# EAGLE design round-epaper-demo (EAGLE 7.5.0)
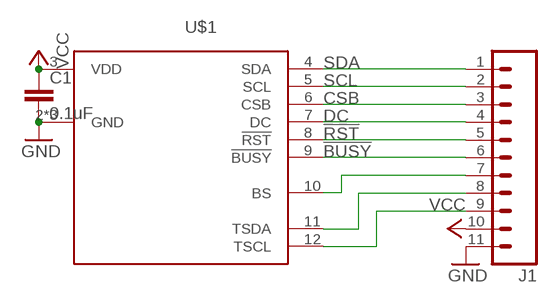
[diagram p0: schematic, sheet 1]

## Parts
C1  0.1uF  CAP0603-CAP  [0603-CAP]
J1  M11PTH  [1X11]
U$1  GDEP011TT2  [FH26W-15S-0.3S]

## Nets
!BUSY: J1.6 U$1.9(!BUSY)
!RST: J1.5 U$1.8(!RST)
BS: J1.7 U$1.10(BS)
CSB: J1.3 U$1.6(CSB)
DC: J1.4 U$1.7(DC)
GND [power]: C1.2 J1.11 U$1.2(GND) U$1.EXP1(GND) U$1.EXP2(GND)
SCL: J1.2 U$1.5(SCL)
SDA: J1.1 U$1.4(SDA)
TSCL: J1.9 U$1.12(TSCL)
TSDA: J1.8 U$1.11(TSDA)
VCC [power]: C1.1 J1.10 U$1.3(VDD)

## Library data of the parts
C1 = SparkFun-Capacitors:CAP: Capacitor Standard 0603 ceramic capacitor, and 0.1" leaded capacitor.
J1 = SparkFun-Connectors:M11: Header 11 Standard 11-pin 0.1" header. Use with straight break away headers (SKU : PRT-00116), right angle break away headers (PRT-00553), swiss pins (PRT-00743), machine pins (PRT-00117), and female headers (PRT-00115).
U$1 = sonik:GDEP011TT2

## Net classes
2 power: width 0.254 mm

## Board
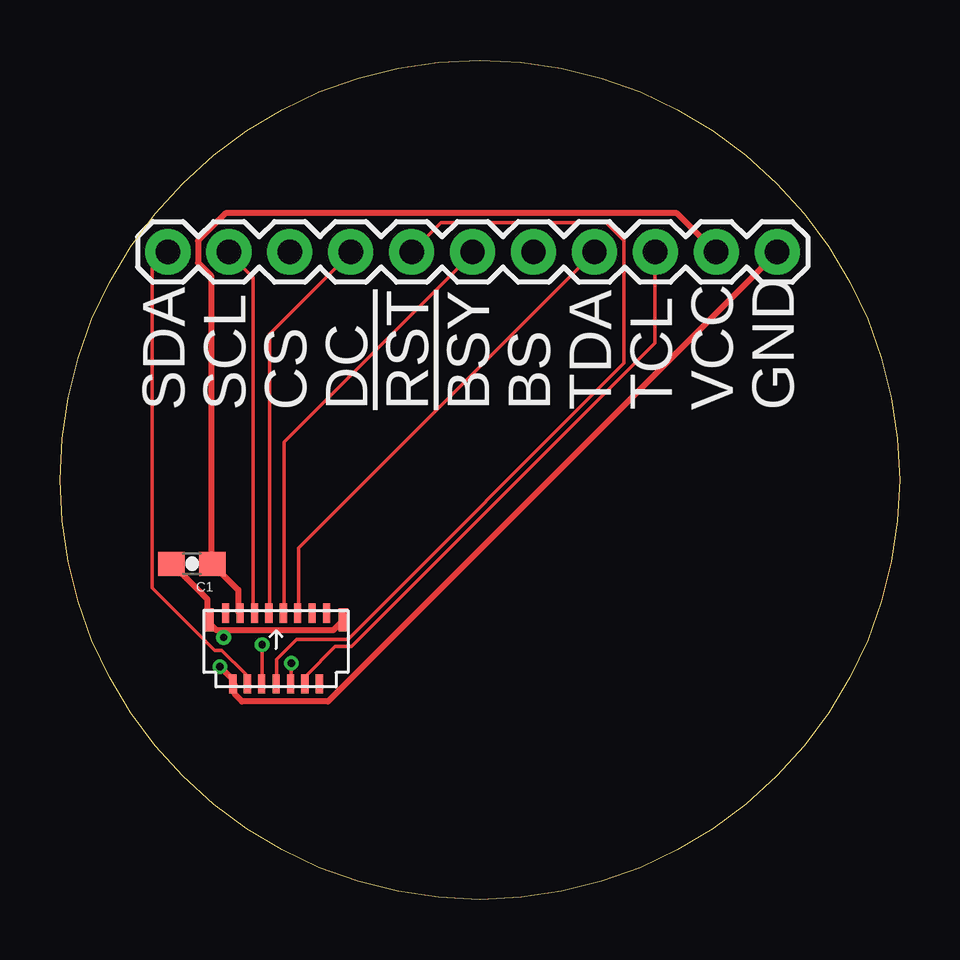
[diagram p1: board, top side]
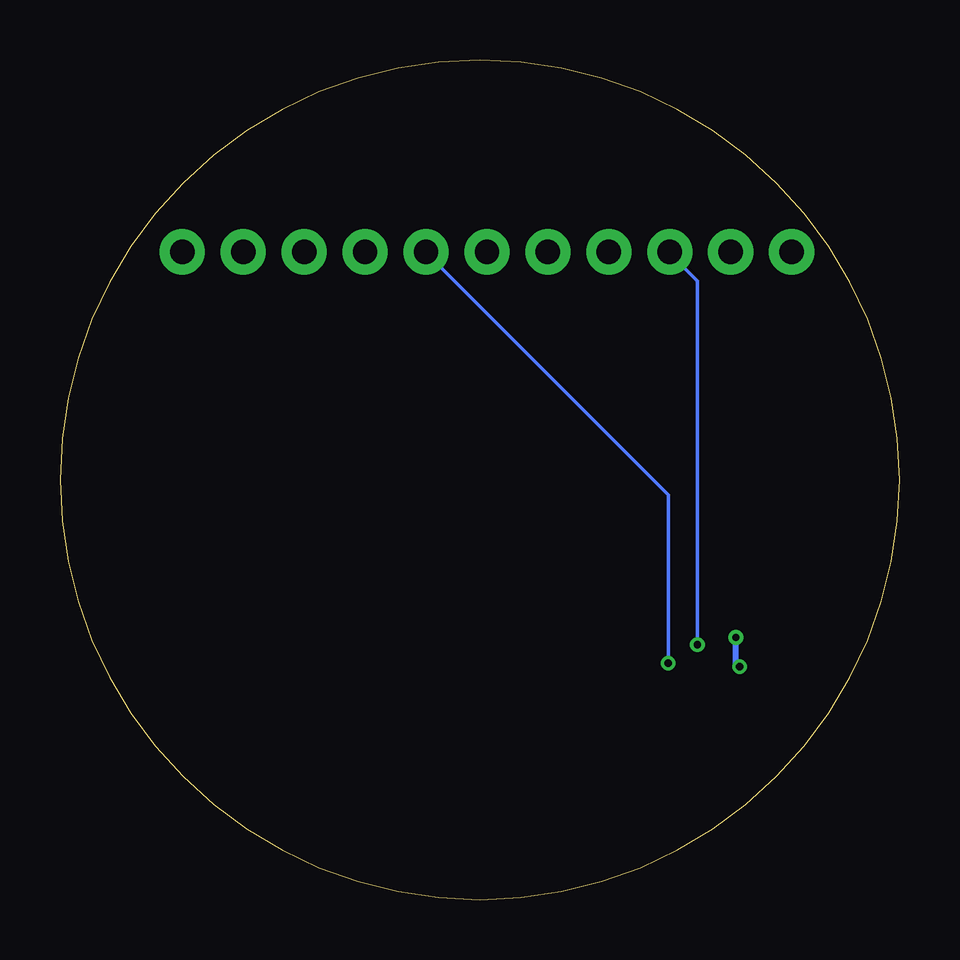
[diagram p2: board, bottom side, seen from below]

Size 35 x 35 mm. Coordinates in mm from the lower left corner, seen from the top.
Outline: 17.5,35 arc-180 17.5,0 arc-180 17.5,35
Copper layers (1*16): Top 0.035mm / dielectric 1.5mm / Bottom 0.035mm
Design rules "MF_Standard_2_Layer": minimum track width 6mil, minimum drill 12mil, track to track 6mil, track to pad 6mil, pad to pad 6mil, via to via 6mil, smd to smd 0mil, copper to edge 10mil, drill to drill 10mil, minimum pad ring 6mil, minimum via ring 6mil, stop-mask expansion 2mil, vias tented up to drill 25mil, thermal gap 10mil

### Footprints (pad centres in the part's own frame; a part is rotated, then mirrored left to right if it is on the bottom)
0603-CAP = smd 1.1 x 1: 1 -0.85,0; 2 0.85,0
1X11 = drill 1.016 pad 1.88: 1 0,0; 2 2.54,0; 3 5.08,0; 4 7.62,0; 5 10.16,0; 6 12.7,0; 7 15.24,0; 8 17.78,0; 9 20.32,0; 10 22.86,0; 11 25.4,0
FH26W-15S-0.3S = smd 0.3 x 0.8: 1 2.1,-1.475; 2 1.8,1.475; 3 1.5,-1.475; 4 1.2,1.475; 5 0.9,-1.475; 6 0.6,1.475; 7 0.3,-1.475; 8 0,1.475; 9 -0.3,-1.475; 10 -0.6,1.475; 11 -0.9,-1.475; 12 -1.2,1.475; 13 -1.5,-1.475; 14 -1.8,1.475; 15 -2.1,-1.475 | smd 0.4 x 0.95: EXP1 -2.8,-1.2; EXP2 2.8,-1.2

### Placement (x,y rotation side)
C1  5.5,14 180 top
J1  4.5,27 0 top
U$1  9.01,10.46 180 top

### Tracks (layer width: path | path; a pad name or v marks a point on that pad's centre or on a via)
!BUSY
  Top 0.152: U$1.9 9.34,11.99 9.34,19.08 17.19,26.93 J1.6
!RST
  Top 0.152: U$1.8 9.04,9.02 9.04,10.01 9.87,10.85 12.01,10.85 23.51,22.36 23.51,27.46 22.75,28.22 15.89,28.22 14.67,27 J1.5
BS  (via drill 0.3)
  Top 0.152: v9.64,9.86 9.64,9.02 U$1.10
  Bottom 0.152: v9.64,9.86 9.64,16.87 19.7,26.93 J1.7
CSB  (via drill 0.3)
  Top 0.152: v8.43,10.62 8.43,9.02 U$1.6
  Bottom 0.152: v8.43,10.62 8.43,25.79 9.57,26.93 J1.3
DC
  Top 0.152: U$1.7 8.73,11.99 8.73,23.57 12.08,26.93 J1.4
GND  (via drill 0.3)
  Top 0.254: C1.2 4.69,13.97 6.14,12.53 6.14,11.69 U$1.EXP2 6.22,11.54 6.52,11.23 6.83,11.23 | 6.83,11.23 11.4,11.23 11.78,11.61 U$1.EXP1 | J1.11 29.84,26.93 11.17,8.26 7.59,8.26 7.28,8.56 7.28,8.95 U$1.2 7.21,9.1 7.21,9.17 v6.67,9.71 | v6.83,10.93 6.83,11.23
  Bottom 0.254: v6.83,10.93 6.83,9.86 v6.67,9.71
SCL
  Top 0.152: U$1.5 8.04,11.99 8.04,25.94 7.05,26.93 J1.2
SDA
  Top 0.152: U$1.4 7.74,9.02 7.74,9.4 6.75,10.39 6.45,10.39 3.85,12.98 3.85,26.32 4.46,26.93 J1.1
TSCL
  Top 0.152: U$1.12 10.25,9.02 10.25,9.33 11.47,10.54 12.16,10.54 24.81,23.19 24.81,26.93 J1.9
TSDA
  Top 0.152: U$1.11 9.95,11.99 9.95,14.66 22.22,26.93 J1.8
VCC
  Top 0.254: U$1.3 7.44,11.99 7.44,12.91 6.37,13.97 C1.1 6.29,14.05 6.29,26.01 5.76,26.55 5.76,27.46 6.9,28.6 25.72,28.6 27.32,27 J1.10

### Text on the board
tNames: SDA | SCL | CS | DC | !RST | !BSY | BS | TDA | TCL | VCC | GND